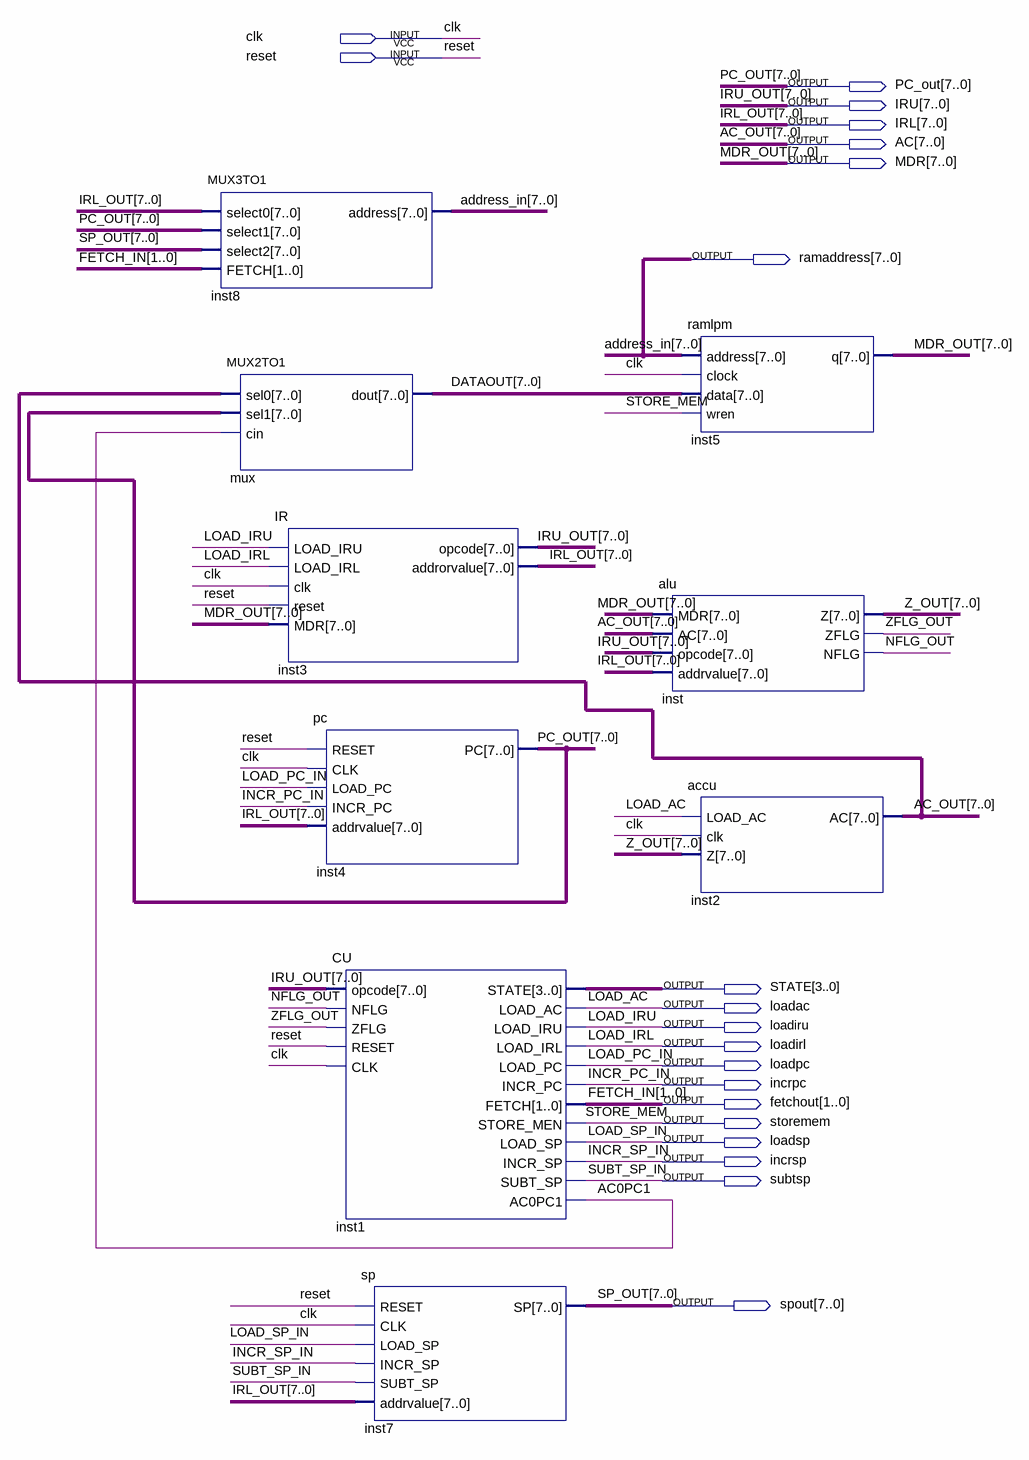
[diagram p0: schematic sheet]
// Quartus schematic MCU.bdf as structural Verilog: 9 symbols, 20 pins
module MCU (
  input  clk,
  input  reset,
  output [7:0] PC_out,
  output [7:0] IRU,
  output [7:0] IRL,
  output [7:0] AC,
  output [7:0] MDR,
  output [7:0] ramaddress,
  output [3:0] STATE,
  output loadac,
  output loadiru,
  output loadirl,
  output loadpc,
  output incrpc,
  output [1:0] fetchout,
  output storemem,
  output loadsp,
  output incrsp,
  output subtsp,
  output [7:0] spout
);

  wire AC0PC1, NFLG_OUT, ZFLG_OUT;
  wire [7:0] DATAOUT, Z_OUT;

  MUX3TO1 inst8 (.select0(IRL), .select1(PC_out), .select2(spout), .FETCH(fetchout), .address(ramaddress));
  MUX2TO1 mux (.sel0(AC), .sel1(PC_out), .cin(AC0PC1), .dout(DATAOUT));
  IR inst3 (
    .LOAD_IRU(loadiru), .LOAD_IRL(loadirl), .clk(clk), .reset(reset), .MDR(MDR), .opcode(IRU),
    .addrorvalue(IRL));
  pc inst4 (.RESET(reset), .CLK(clk), .LOAD_PC(loadpc), .INCR_PC(incrpc), .addrvalue(IRL), .PC(PC_out));
  CU inst1 (
    .opcode(IRU), .NFLG(NFLG_OUT), .ZFLG(ZFLG_OUT), .RESET(reset), .CLK(clk), .STATE(STATE),
    .LOAD_AC(loadac), .LOAD_IRU(loadiru), .LOAD_IRL(loadirl), .LOAD_PC(loadpc), .INCR_PC(incrpc),
    .FETCH(fetchout), .STORE_MEN(storemem), .LOAD_SP(loadsp), .INCR_SP(incrsp), .SUBT_SP(subtsp),
    .AC0PC1(AC0PC1));
  sp inst7 (
    .RESET(reset), .CLK(clk), .LOAD_SP(loadsp), .INCR_SP(incrsp), .SUBT_SP(subtsp), .addrvalue(IRL),
    .SP(spout));
  ramlpm inst5 (.address(ramaddress), .clock(clk), .data(DATAOUT), .wren(storemem), .q(MDR));
  alu inst (.MDR(MDR), .AC(AC), .opcode(IRU), .addrvalue(IRL), .Z(Z_OUT), .ZFLG(ZFLG_OUT), .NFLG(NFLG_OUT));
  accu inst2 (.LOAD_AC(loadac), .clk(clk), .Z(Z_OUT), .AC(AC));

  // Other names for the same wires on the sheet: AC_OUT[7:0] = AC; FETCH_IN[1:0] = fetchout; INCR_PC_IN = incrpc;
  //   INCR_SP_IN = incrsp; IRL_OUT[7:0] = IRL; IRU_OUT[7:0] = IRU; LOAD_AC = loadac; LOAD_IRL = loadirl;
  //   LOAD_IRU = loadiru; LOAD_PC_IN = loadpc; LOAD_SP_IN = loadsp; MDR_OUT[7:0] = MDR; address_in[7:0] = ramaddress;
  //   SP_OUT[7:0] = spout; STORE_MEM = storemem; SUBT_SP_IN = subtsp
endmodule
